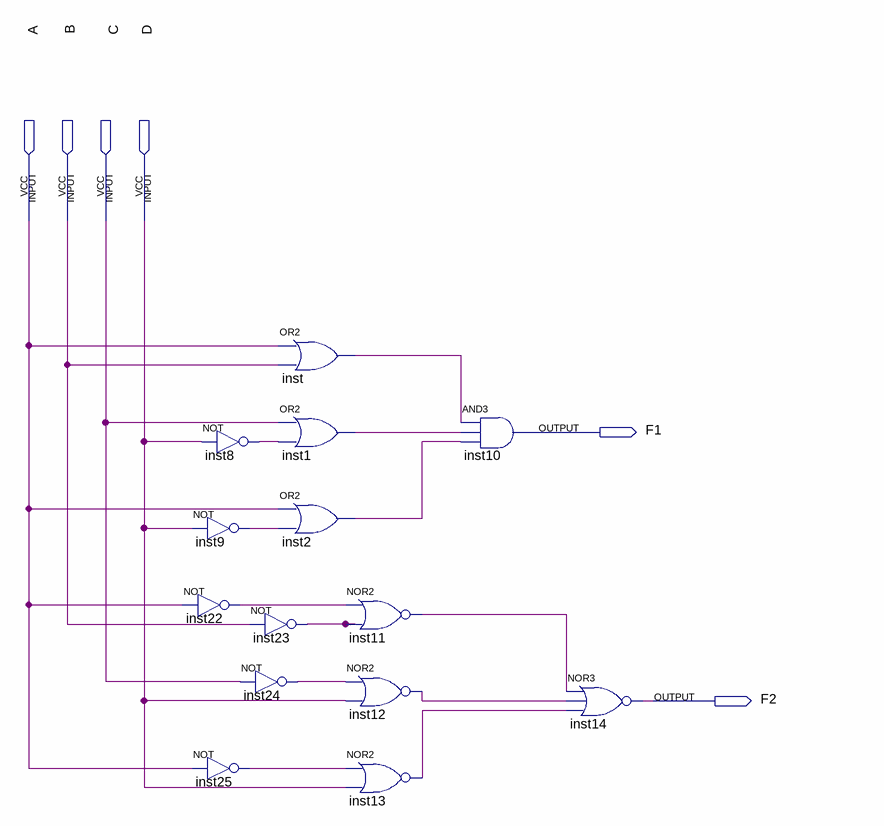
[diagram p0: schematic sheet]
// Quartus schematic HW3P3.bdf as structural Verilog: 14 symbols, 6 pins
module HW3P3 (
  input  A,
  input  B,
  input  C,
  input  D,
  output F1,
  output F2
);

  wire inst1_out, inst2_out, inst8_out, inst9_out, inst11_out, inst12_out, inst13_out, inst22_out,
       inst23_out, inst24_out, inst25_out, inst_out;

  not inst8 (inst8_out, D);
  not inst9 (inst9_out, D);
  not inst22 (inst22_out, A);
  not inst25 (inst25_out, A);
  or inst (inst_out, A, B);
  or inst1 (inst1_out, C, inst8_out);
  or inst2 (inst2_out, A, inst9_out);
  not inst23 (inst23_out, B);
  not inst24 (inst24_out, C);
  nor inst11 (inst11_out, inst22_out, inst23_out);
  nor inst12 (inst12_out, inst24_out, D);
  nor inst13 (inst13_out, inst25_out, D);
  and inst10 (F1, inst_out, inst1_out, inst2_out);
  nor inst14 (F2, inst11_out, inst12_out, inst13_out);
endmodule
